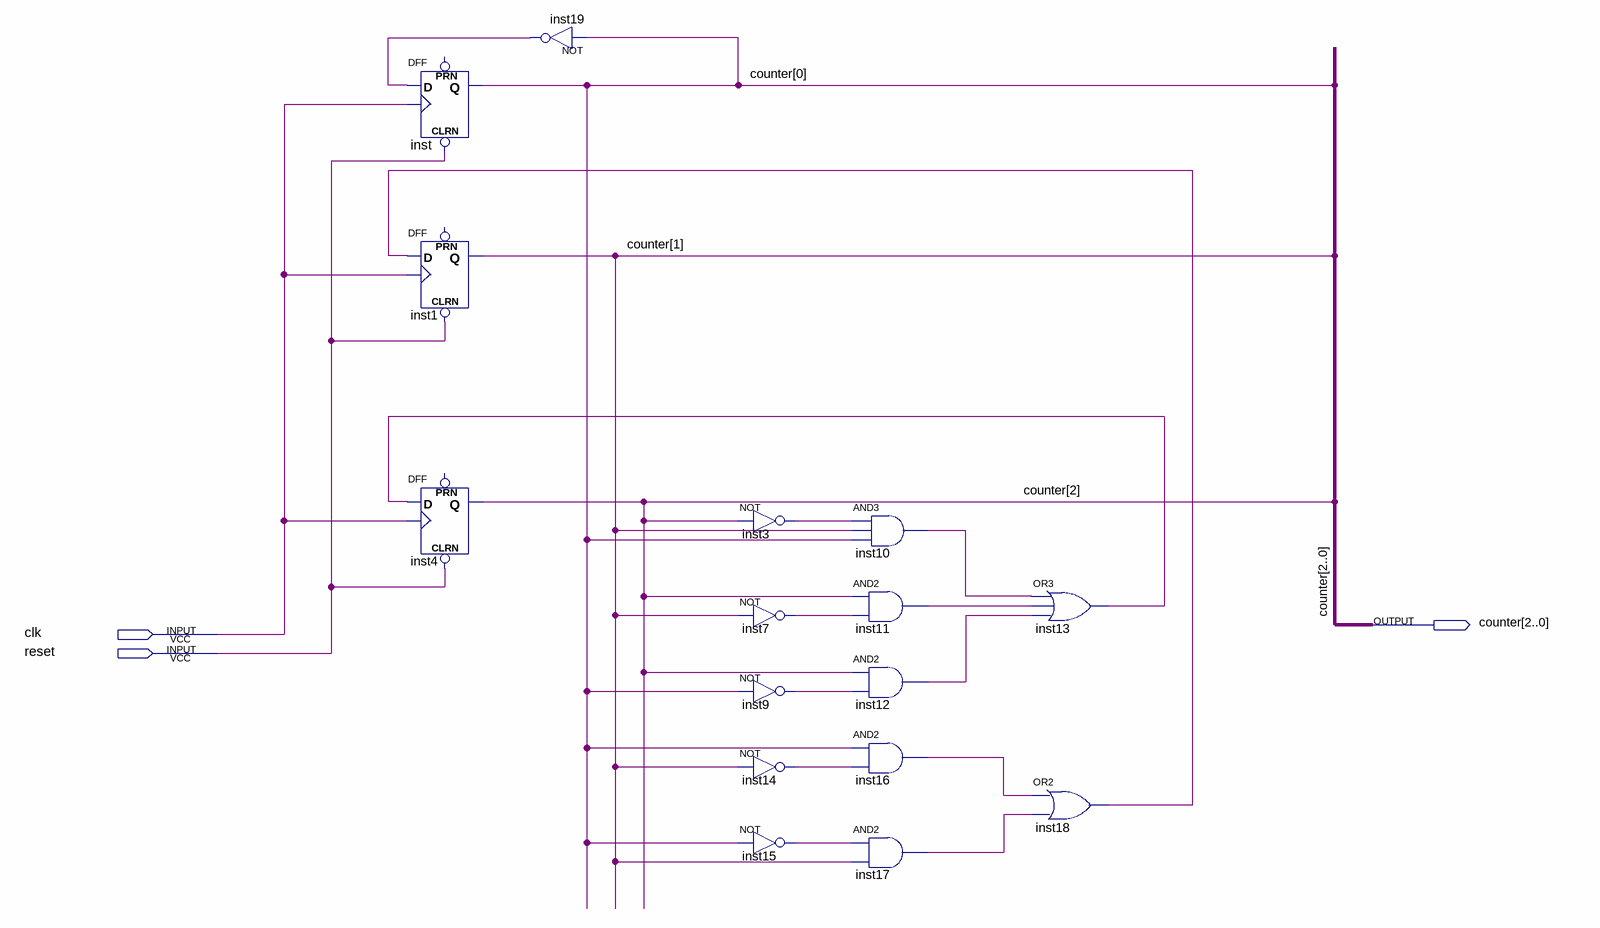
[diagram p0: schematic sheet]
// Quartus schematic counter3.bdf as structural Verilog: 16 symbols, 3 pins
module counter3 (
  input  clk,
  input  reset,
  output [2:0] counter
);

  wire inst3_out, inst7_out, inst9_out, inst10_out, inst11_out, inst12_out, inst13_out, inst14_out,
       inst15_out, inst16_out, inst17_out, inst18_out, inst19_out;

  DFF inst (.CLRN(reset), .CLK(clk), .D(inst19_out), .Q(counter[0]));  // open: PRN
  DFF inst1 (.CLRN(reset), .CLK(clk), .D(inst18_out), .Q(counter[1]));  // open: PRN
  DFF inst4 (.CLRN(reset), .CLK(clk), .D(inst13_out), .Q(counter[2]));  // open: PRN
  not inst19 (inst19_out, counter[0]);
  not inst3 (inst3_out, counter[2]);
  not inst7 (inst7_out, counter[1]);
  not inst9 (inst9_out, counter[0]);
  not inst14 (inst14_out, counter[1]);
  not inst15 (inst15_out, counter[0]);
  and inst10 (inst10_out, inst3_out, counter[1], counter[0]);
  and inst11 (inst11_out, counter[2], inst7_out);
  and inst12 (inst12_out, counter[2], inst9_out);
  and inst16 (inst16_out, counter[0], inst14_out);
  and inst17 (inst17_out, inst15_out, counter[1]);
  or inst13 (inst13_out, inst10_out, inst11_out, inst12_out);
  or inst18 (inst18_out, inst16_out, inst17_out);
endmodule
